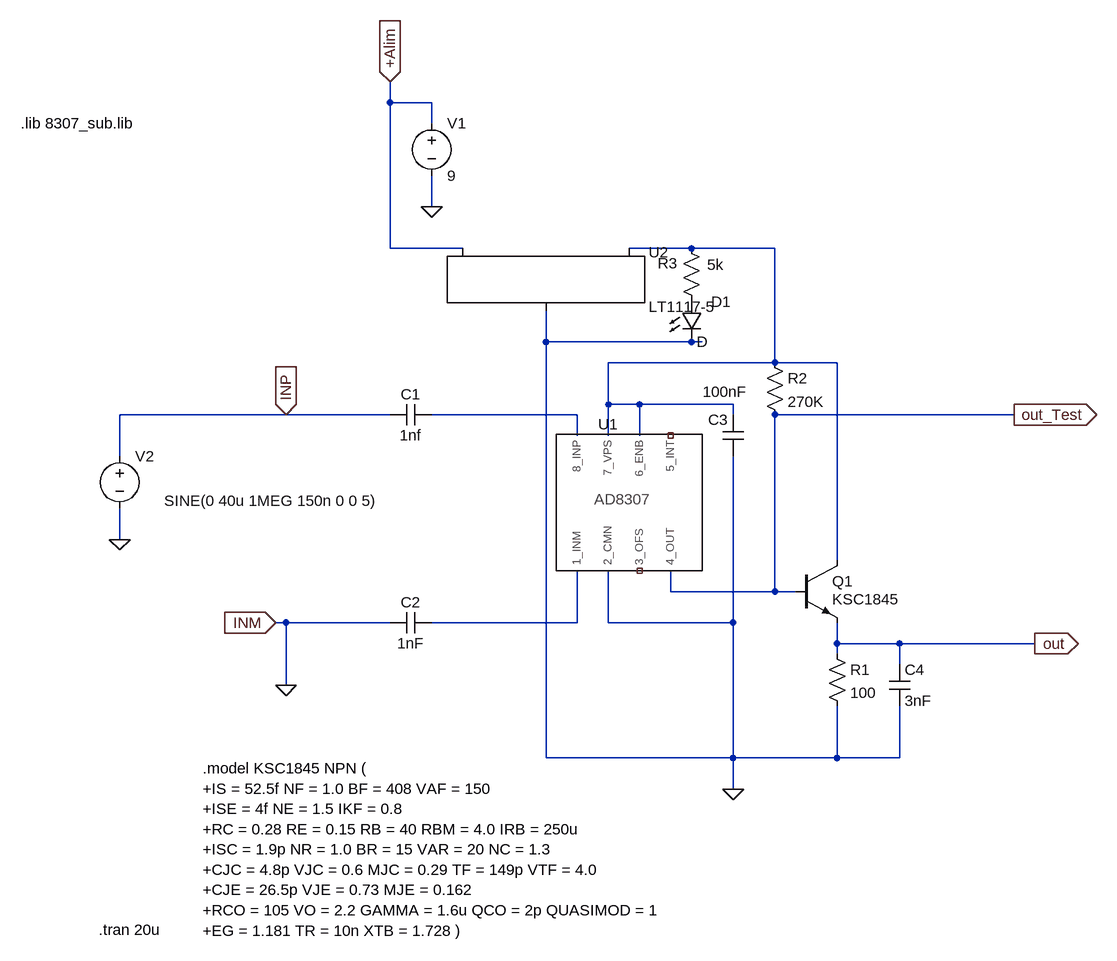
[diagram p0: schematic EMI_detector_8307.asc]
EMI_detector_8307.asc, the LTspice schematic file:
Version 4
SHEET 1 960 904
WIRE -176 -384 -176 -416
WIRE -112 -384 -176 -384
WIRE -112 -352 -112 -384
WIRE -112 -224 -112 -272
WIRE -176 -160 -176 -384
WIRE -64 -160 -176 -160
WIRE 288 -160 192 -160
WIRE 416 -160 288 -160
WIRE 64 -16 64 -64
WIRE 288 -16 64 -16
WIRE 304 -16 288 -16
WIRE 416 16 416 -160
WIRE 416 16 160 16
WIRE 512 16 416 16
WIRE 160 80 160 16
WIRE 208 80 160 80
WIRE 352 80 208 80
WIRE -336 96 -592 96
WIRE -176 96 -336 96
WIRE 112 96 -112 96
WIRE 352 96 352 80
WIRE 784 96 416 96
WIRE 112 128 112 96
WIRE 160 128 160 80
WIRE 208 128 208 80
WIRE -592 160 -592 96
WIRE -592 288 -592 240
WIRE 512 320 512 16
WIRE 256 368 256 336
WIRE 416 368 416 96
WIRE 416 368 256 368
WIRE 448 368 416 368
WIRE -336 416 -352 416
WIRE -176 416 -336 416
WIRE 112 416 112 336
WIRE 112 416 -112 416
WIRE 160 416 160 336
WIRE 352 416 352 160
WIRE 352 416 160 416
WIRE 512 448 512 416
WIRE 608 448 512 448
WIRE 816 448 608 448
WIRE 512 464 512 448
WIRE 608 480 608 448
WIRE -336 512 -336 416
WIRE 64 624 64 -16
WIRE 352 624 352 416
WIRE 352 624 64 624
WIRE 512 624 512 544
WIRE 512 624 352 624
WIRE 608 624 608 544
WIRE 608 624 512 624
WIRE 352 672 352 624
FLAG 352 672 0
FLAG 816 448 out
IOPIN 816 448 Out
FLAG -336 96 INP
IOPIN -336 96 In
FLAG -352 416 INM
IOPIN -352 416 In
FLAG -176 -416 +Alim
IOPIN -176 -416 In
FLAG 784 96 out_Test
IOPIN 784 96 Out
FLAG -112 -224 0
FLAG -336 512 0
FLAG -592 288 0
SYMBOL cap -112 80 R90
WINDOW 0 0 32 VBottom 2
WINDOW 3 32 32 VTop 2
SYMATTR InstName C1
SYMATTR Value 1nf
SYMBOL cap -112 400 R90
WINDOW 0 0 32 VBottom 2
WINDOW 3 32 32 VTop 2
SYMATTR InstName C2
SYMATTR Value 1nF
SYMBOL cap 368 160 R180
WINDOW 0 24 56 Left 2
WINDOW 3 -6 99 Left 2
SYMATTR InstName C3
SYMATTR Value 100nF
SYMBOL npn 448 320 R0
WINDOW 3 56 60 Left 2
SYMATTR Value KSC1845
SYMATTR InstName Q1
SYMBOL res 496 448 R0
SYMATTR InstName R1
SYMATTR Value 100
SYMBOL cap 592 480 R0
SYMATTR InstName C4
SYMATTR Value 3nF
SYMBOL voltage -112 -368 R0
WINDOW 123 0 0 Left 0
WINDOW 39 0 0 Left 0
SYMATTR InstName V1
SYMATTR Value 9
SYMBOL voltage -592 144 R0
WINDOW 123 0 0 Left 0
WINDOW 39 0 0 Left 0
WINDOW 3 69 84 Left 2
SYMATTR Value SINE(0 40u 1MEG 150n 0 0 5)
SYMATTR InstName V2
SYMBOL 8307_SUB 144 288 R0
SYMATTR InstName U1
SYMBOL PowerProducts\\LT1117-5 64 -160 R0
SYMATTR InstName U2
SYMBOL res 400 0 R0
SYMATTR InstName R2
SYMATTR Value 270K
SYMBOL LED 272 -80 R0
WINDOW 0 46 2 Left 2
SYMATTR InstName D1
SYMBOL res 272 -176 R0
WINDOW 0 -36 39 Left 2
WINDOW 3 40 41 Left 2
SYMATTR InstName R3
SYMATTR Value 5k
TEXT -464 640 Left 2 !.model KSC1845 NPN (\n+IS = 52.5f NF = 1.0 BF = 408 VAF = 150\n+ISE = 4f NE = 1.5 IKF = 0.8\n+RC = 0.28 RE = 0.15 RB = 40 RBM = 4.0 IRB = 250u\n+ISC = 1.9p NR = 1.0 BR = 15 VAR = 20 NC = 1.3\n+CJC = 4.8p VJC = 0.6 MJC = 0.29 TF = 149p VTF = 4.0\n+CJE = 26.5p VJE = 0.73 MJE = 0.162\n+RCO = 105 VO = 2.2 GAMMA = 1.6u QCO = 2p QUASIMOD = 1\n+EG = 1.181 TR = 10n XTB = 1.728 )
TEXT -624 888 Left 2 !.tran 20u
TEXT -744 -352 Left 2 !.lib 8307_sub.lib

The netlist it stands for:
* EMI_detector_8307.asc
C1 N002 INP 1nf
C2 N003 0 1nF
C3 0 N001 100nF
Q1 N001 out_Test out 0 KSC1845
R1 out 0 100
C4 out 0 3nF
V1 +Alim 0 9
V2 INP 0 SINE(0 40u 1MEG 150n 0 0 5)
XU1 N003 0 NC_01 out_Test NC_02 N001 N001 N002 8307_SUB  ; pins 1_INM 2_CMN 3_OFS 4_OUT 5_INT 6_ENB 7_VPS 8_INP
XU2 0 N001 +Alim LT1117-5
R2 N001 out_Test 270K
D1 P001 0 D
R3 N001 P001 5k
.model D D
.lib standard.dio
.model NPN NPN
.model PNP PNP
.lib standard.bjt
.model KSC1845 NPN (
+IS = 52.5f NF = 1.0 BF = 408 VAF = 150
+ISE = 4f NE = 1.5 IKF = 0.8
+RC = 0.28 RE = 0.15 RB = 40 RBM = 4.0 IRB = 250u
+ISC = 1.9p NR = 1.0 BR = 15 VAR = 20 NC = 1.3
+CJC = 4.8p VJC = 0.6 MJC = 0.29 TF = 149p VTF = 4.0
+CJE = 26.5p VJE = 0.73 MJE = 0.162
+RCO = 105 VO = 2.2 GAMMA = 1.6u QCO = 2p QUASIMOD = 1
+EG = 1.181 TR = 10n XTB = 1.728 )
.tran 20u
.lib 8307_sub.lib
.backanno
.end